# EAGLE design synthesizer-IF-Si4112-v1 (EAGLE 9.5.1)
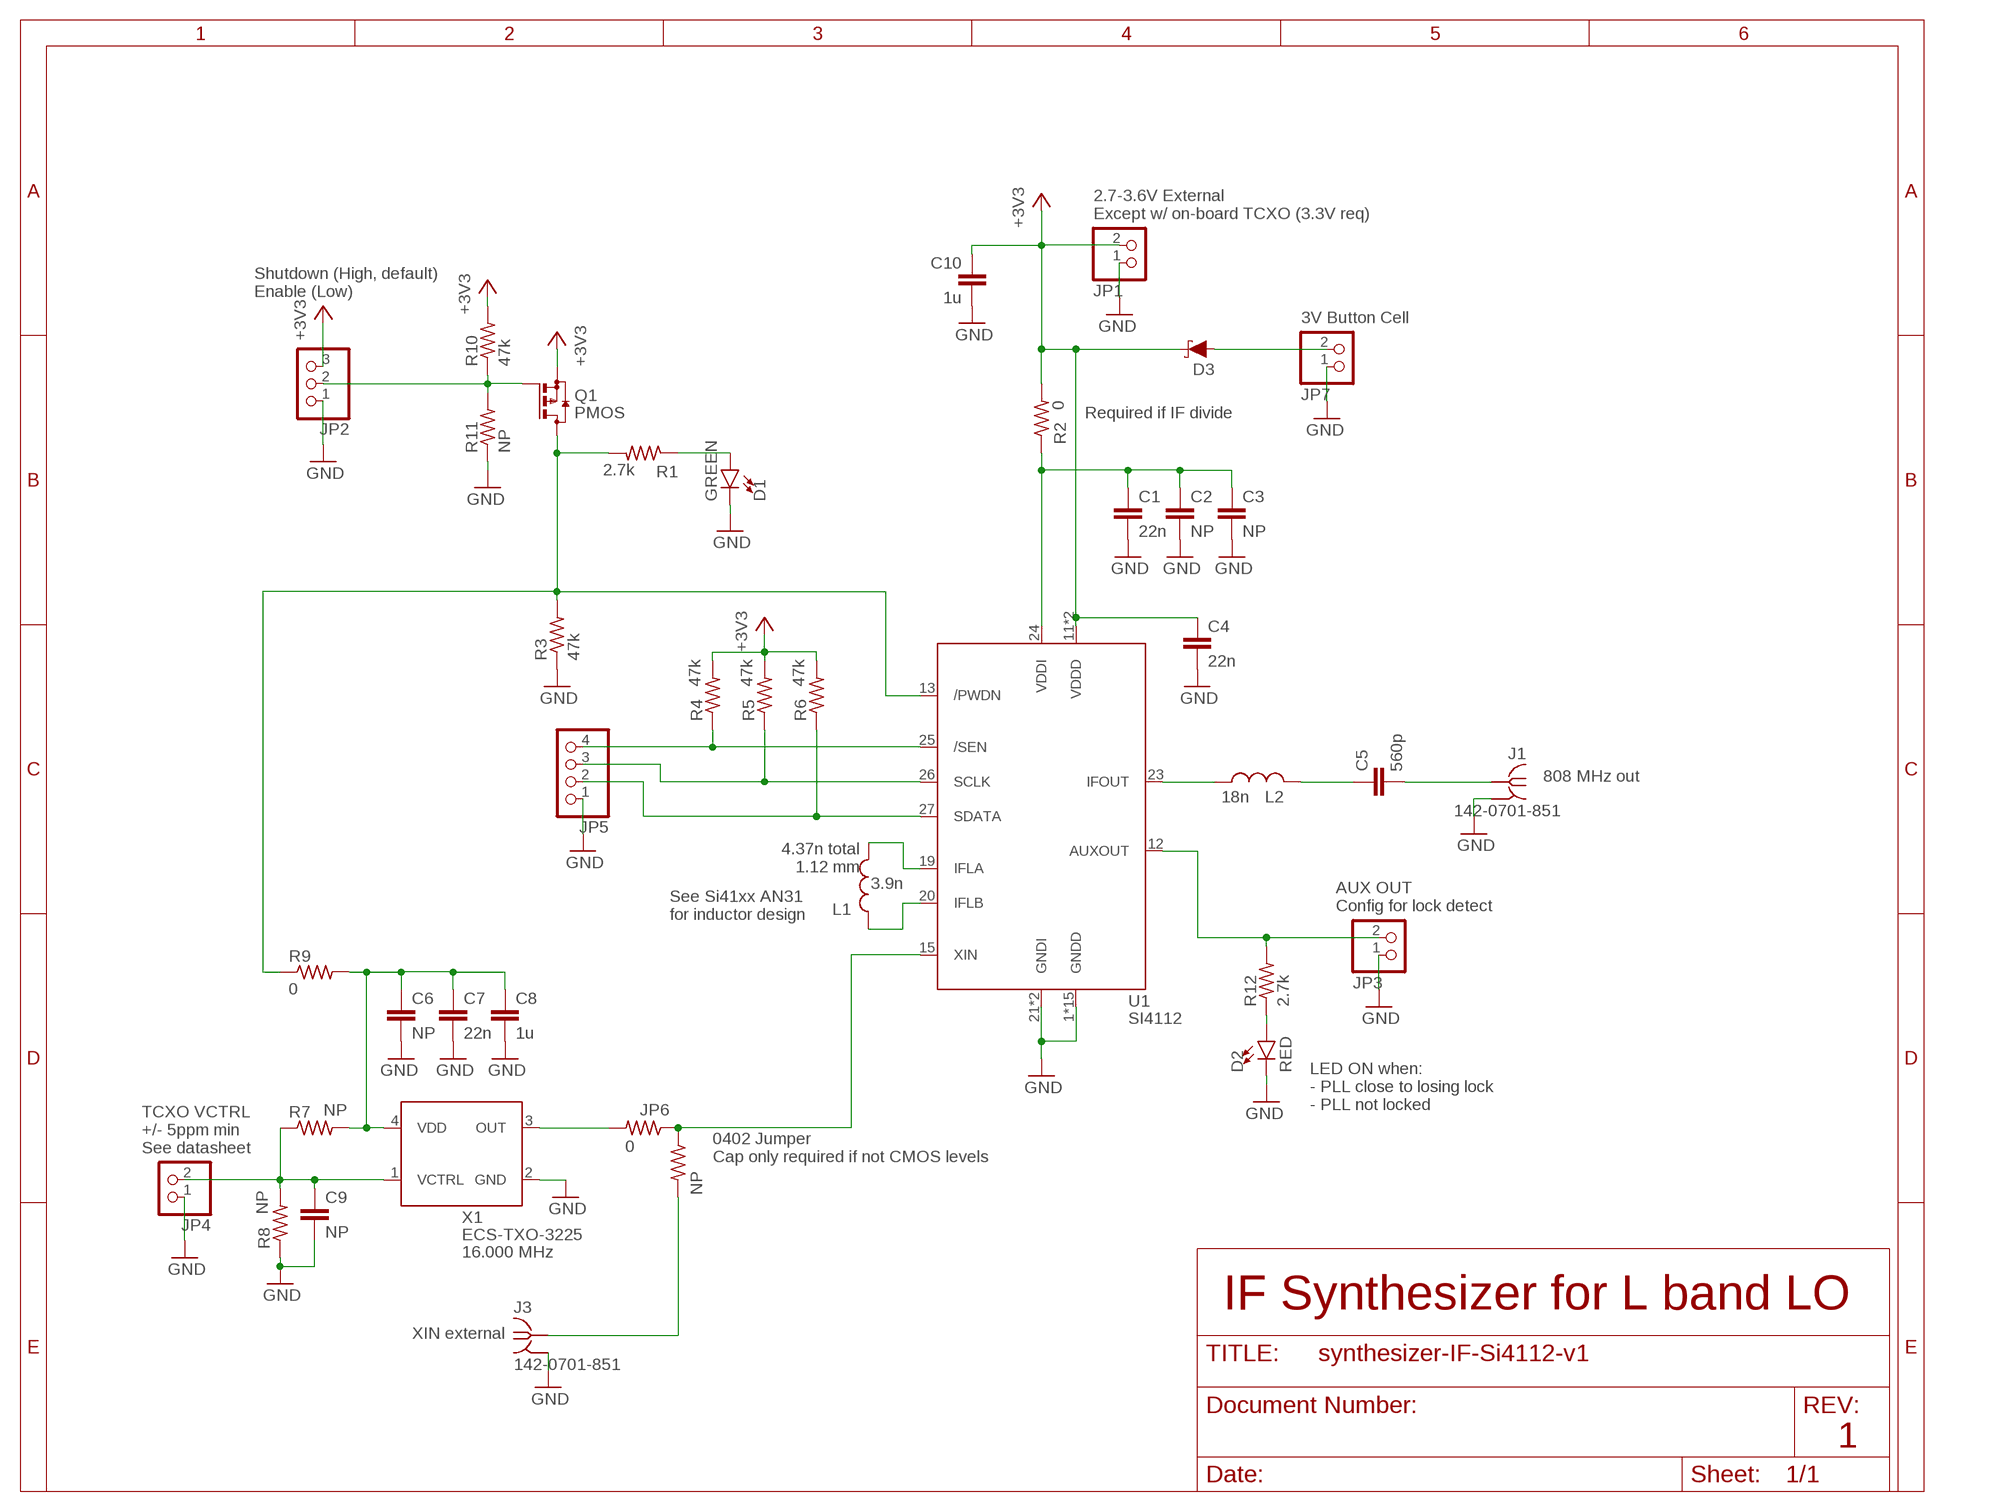
[diagram p0: schematic, sheet 1]

## Parts
C1  22n  C-EU0603-B-NOSILK  [.0603-B-NOSILK]
C2  NP  C-EU0603-B-NOSILK  [.0603-B-NOSILK]
C3  NP  C-EU0603-B-NOSILK  [.0603-B-NOSILK]
C4  22n  C-EU0603-B-NOSILK  [.0603-B-NOSILK]
C5  560p  C-EU0402-B-NOSILK  [.0402-B-NOSILK]
C6  NP  C-EU0603-B-NOSILK  [.0603-B-NOSILK]
C7  22n  C-EU0603-B-NOSILK  [.0603-B-NOSILK]
C8  1u  C-EU0603-B-NOSILK  [.0603-B-NOSILK]
C9  NP  C-EU0603-B-NOSILK  [.0603-B-NOSILK]
C10  1u  C-EU0603-B-NOSILK  [.0603-B-NOSILK]
D1  GREEN  LED-GREEN0603  [LED-0603]
D2  RED  LED-GREEN0603  [LED-0603]
D3  120mA/40V/370mV  DIODE-SCHOTTKY-RB751S40  [SOD-523]
J1  142-0701-851  [142-0701-851]
J3  142-0701-851  [142-0701-851]
JP1  PINHD-1X2  [1X02]
JP2  PINHD-1X3  [1X03]
JP3  PINHD-1X2  [1X02]
JP4  PINHD-1X2  [1X02]
JP5  PINHD-1X4  [1X04]
JP6  0  R-US_0402-B-NOSILK  [.0402-B-NOSILK]
JP7  PINHD-1X2  [1X02]
L1  3.9n  L-US0402-C-NOSILK  [.0402-C-NOSILK]
L2  18n  L-US0402-B-NOSILK  [.0402-B-NOSILK]
Q1  PMOS  BSS84  [SOT23]
R1  2.7k  R-US_0603-B-NOSILK  [.0603-B-NOSILK]
R2  0  R-US_0603-B-NOSILK  [.0603-B-NOSILK]
R3  47k  R-US_0402-B-NOSILK  [.0402-B-NOSILK]
R4  47k  R-US_0402-B-NOSILK  [.0402-B-NOSILK]
R5  47k  R-US_0402-B-NOSILK  [.0402-B-NOSILK]
R6  47k  R-US_0402-B-NOSILK  [.0402-B-NOSILK]
R7  NP  R-US_0603-B-NOSILK  [.0603-B-NOSILK]
R8  NP  R-US_0603-B-NOSILK  [.0603-B-NOSILK]
R9  0  R-US_0603-B-NOSILK  [.0603-B-NOSILK]
R10  47k  R-US_0402-B-NOSILK  [.0402-B-NOSILK]
R11  NP  R-US_0402-B-NOSILK  [.0402-B-NOSILK]
R12  2.7k  R-US_0603-B-NOSILK  [.0603-B-NOSILK]
R99  NP  R-US_0402-B-NOSILK  [.0402-B-NOSILK]
U1  SI4112  [QFN28-5X5-WITH-CENTER-PAD]
X1  ECS-TXO-3225  [3.2X2.5]

## Nets
+3V3: C4.1 C10.1 D3.C JP1.2 JP2.3 Q1.2(S) R2.2 R4.2 R5.2 R6.2 R10.2 U1.11(VDDD) U1.17(VDDD)
/SEN: JP5.4 R4.1 U1.25(/SEN)
AUX: JP3.2 R12.2 U1.12(AUXOUT)
GND: C1.2 C2.2 C3.2 C4.2 C6.2 C7.2 C8.2 C9.2 C10.2 D1.C D2.C J1.GND1(GND) J1.GND2(GND) J1.GND3(GND) J1.GND4(GND) J3.GND1(GND) J3.GND2(GND) J3.GND3(GND) J3.GND4(GND) JP1.1 JP2.1 JP3.1 JP4.1 JP5.1 JP7.1 R3.1 R8.1 R11.1 U1.1(GNDD) U1.2(GNDD) U1.3(GNDD) U1.4(GNDD) U1.5(GNDD) U1.6(GNDD) U1.7(GNDD) U1.8(GNDD) U1.9(GNDD) U1.10(GNDD) U1.14(GNDD) U1.16(GNDD) U1.18(GNDD) U1.21(GNDI) U1.22(GNDI) U1.28(GNDD) U1.PAD(GNDD) X1.2(GND)
IF_OUT [RF1]: C5.2 J1.RF1(RF)
N$1: D3.A JP7.2
N$2: L1.2 U1.19(IFLA)
N$3: L1.1 U1.20(IFLB)
N$4: JP2.2 Q1.1(G) R10.1 R11.2
N$5: Q1.3(D) R1.2 R3.2 R9.1 U1.13(/PWDN)
N$9 [RF3]: JP6.2 X1.3(OUT)
N$10: C6.1 C7.1 C8.1 R7.2 R9.2 X1.4(VDD)
N$11 [RF1]: C5.1 L2.2
N$21: D1.A R1.1
N$22: D2.A R12.1
N$25 [RF2]: L2.1 U1.23(IFOUT)
N$93: C1.1 C2.1 C3.1 R2.1 U1.24(VDDI)
REF_IN [RF1]: J3.RF1(RF) R99.2
SCLK: JP5.3 R5.1 U1.26(SCLK)
SDATA: JP5.2 R6.1 U1.27(SDATA)
VCTRL: C9.1 JP4.2 R7.1 R8.2 X1.1(VCTRL)
XIN [RF2]: JP6.1 R99.1 U1.15(XIN)

## Notes on the sheet
- 2.7-3.6V External
  Except w/ on-board TCXO (3.3V req)
- Shutdown (High, default)
  Enable (Low)
- 3V Button Cell
- Required if IF divide
- 808 MHz out
- 4.37n total
  1.12 mm
- AUX OUT
  Config for lock detect
- See Si41xx AN31
  for inductor design
- LED ON when:
  - PLL close to losing lock
  - PLL not locked
- TCXO VCTRL
  +/- 5ppm min
  See datasheet
- 0402 Jumper
  Cap only required if not CMOS levels
- 16.000 MHz
- IF Synthesizer for L band LO
- XIN external
- 1

## Library data of the parts
C1-C10 = oresat-rcl:C-EU: CAPACITOR, European symbol
D1 = SparkFun-LED:LED-GREEN: Green SMD LED Used in manufacturing of various products at SparkFun Packages: 0603 - SMD 0603 package [Product Link] <http://www.futureelectronics.com/en/technologies/semiconductors/optoelectronics/leds/Pages/9894312-LTST-C190GKT.aspx?CrossPart=HSMG-C190&IM=0> LilyPad 1206 - SMD1206 LilyPad package [Product Link] <http://www.futureelectronics.com/en/Technologies/Product.aspx?ProductID=IN150NGHARVATEKCORPORATION2049943&IM=0> 1206 - SMD1206 package [Product Link] <http://www.futureelectronics.com/en/technologies/semiconductors/optoelectronics/leds/Pages/8315665-LTST-C150KGKT.aspx?IM=0> 1206 Bottom Mount -SMD 1206 Bottom Mount [Product Link] <http://www.digikey.com/product-detail/en/lite-on-inc/LTST-C230KGKT/160-1456-1-ND/386854> SparkFun Products: Pro Mini 328 -5V <https://www.sparkfun.com/products/821> RedBoard <https://www.sparkfun.com/products/12757> MP3 Trigger <https://www.sparkfun.com/products/13720> Makey Makey <https://www.sparkfun.com/products/11076>
D2 = SparkFun-LED:LED-GREEN: Green SMD LED Used in manufacturing of various products at SparkFun Packages: 0603 - SMD 0603 package [Product Link] <http://www.futureelectronics.com/en/technologies/semiconductors/optoelectronics/leds/Pages/9894312-LTST-C190GKT.aspx?CrossPart=HSMG-C190&IM=0> LilyPad 1206 - SMD1206 LilyPad package [Product Link] <http://www.futureelectronics.com/en/Technologies/Product.aspx?ProductID=IN150NGHARVATEKCORPORATION2049943&IM=0> 1206 - SMD1206 package [Product Link] <http://www.futureelectronics.com/en/technologies/semiconductors/optoelectronics/leds/Pages/8315665-LTST-C150KGKT.aspx?IM=0> 1206 Bottom Mount -SMD 1206 Bottom Mount [Product Link] <http://www.digikey.com/product-detail/en/lite-on-inc/LTST-C230KGKT/160-1456-1-ND/386854> SparkFun Products: Pro Mini 328 -5V <https://www.sparkfun.com/products/821> RedBoard <https://www.sparkfun.com/products/12757> MP3 Trigger <https://www.sparkfun.com/products/13720> Makey Makey <https://www.sparkfun.com/products/11076>; VALUE: GREEN
D3 = SparkFun-DiscreteSemi:DIODE-SCHOTTKY: Schottky diode A Schottky diode is a semiconductor diode which has a low forward voltage drop and a very fast switching action.; PROD_ID: DIO-11018
J1 J3 = J-Cinch-142-0701-851-SMA-end-launch:142-0701-851: SMA Jack 50Ω - End Launch Source: Datasheet <https://belfuse.com/resources/productinformations/cinchconnectivitysolutions/johnson/pi-ccs-john-142-0701-851.pdf>
JP1 JP3 JP4 JP7 = pinhead:PINHD-1X2: PIN HEADER
JP2 = pinhead:PINHD-1X3: PIN HEADER
JP5 = pinhead:PINHD-1X4: PIN HEADER
JP6 R1-R12 R99 = oresat-rcl:R-US_: RESISTOR, American symbol
L1 L2 = oresat-rcl:L-US: INDUCTOR, American symbol
Q1 = transistor-small-signal:BSS84: P-CHANNEL MOS FET
U1 = U-Silicon-Labs-Si4133-synthesizer:SI4112: RF Synthesizer w/ integrated VCOs (IF OUT)
X1 = X-ECS-TXO-TCXO:ECS-TXO-3225: HCMOS TCXO Stability: 2.5ppm (-30 to +85 ℃) Source: Datasheet <https://ecsxtal.com/store/pdf/ECS-TXO-3225.pdf>

## Net classes
1 RF1: clearance 0.762 mm
2 RF2: clearance 0.203 mm
3 RF3: clearance 0.356 mm

## Board
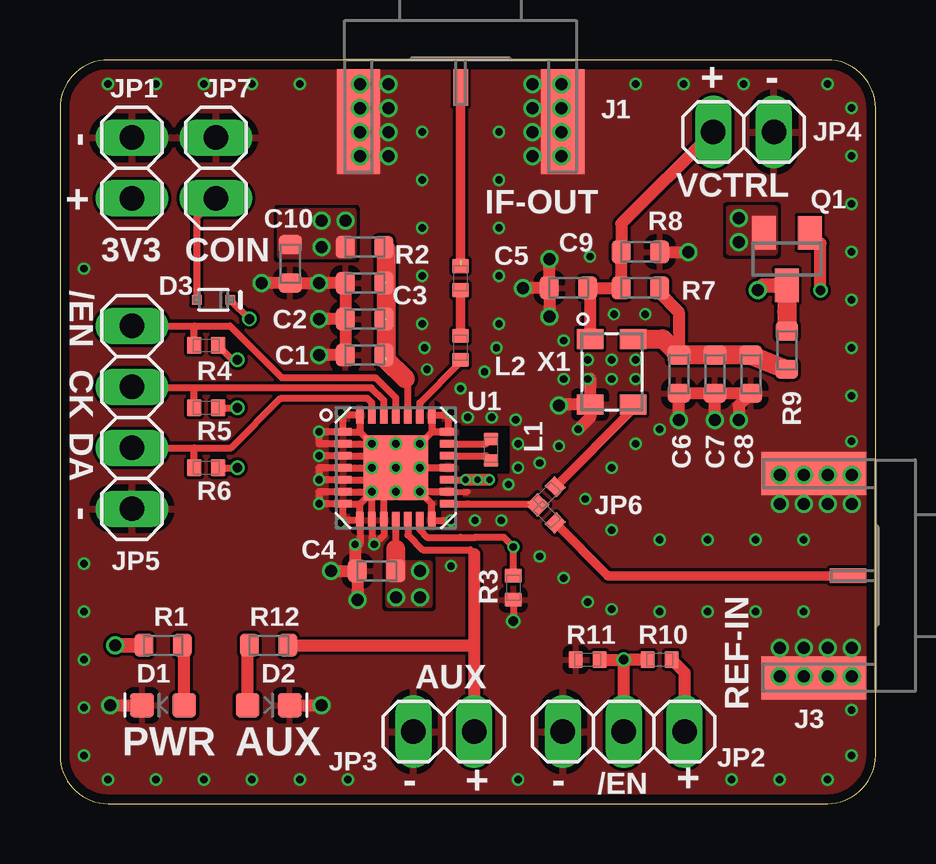
[diagram p1: board, top side]
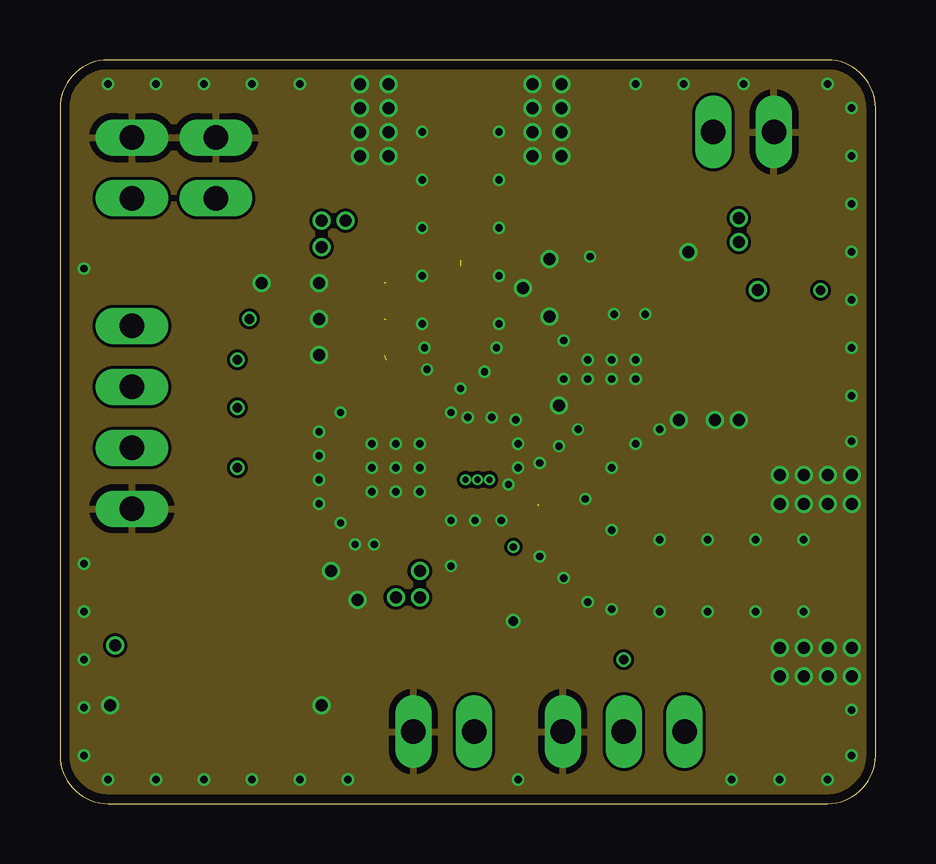
[diagram p2: board, inner layer Route2]
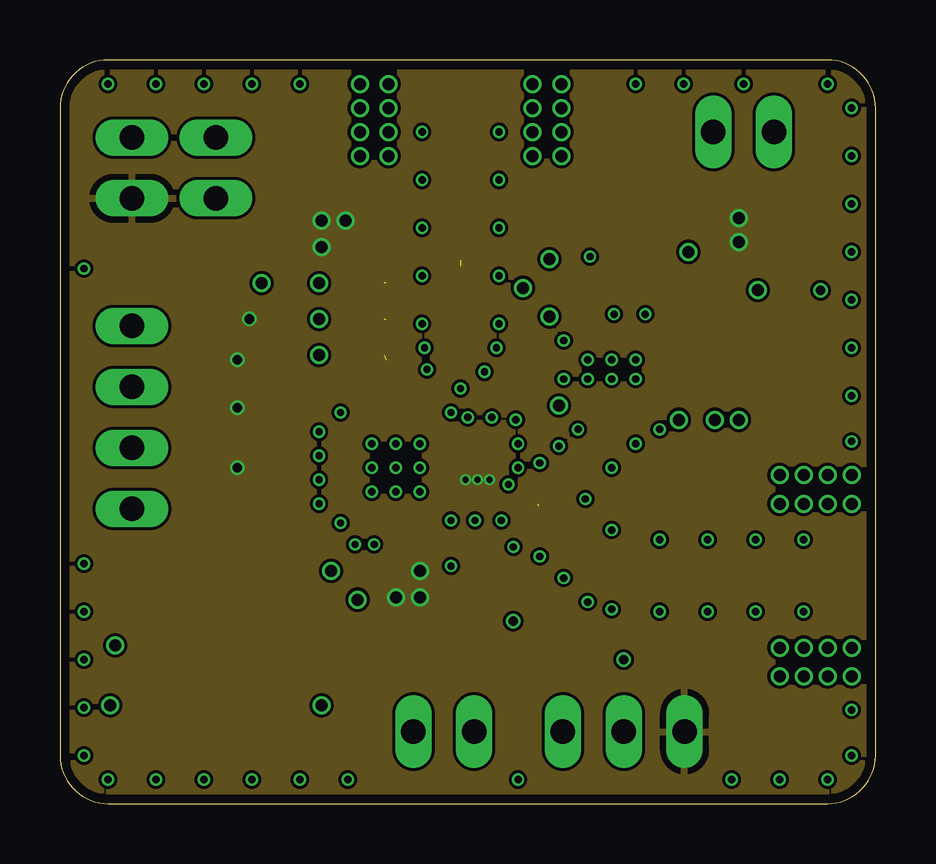
[diagram p3: board, inner layer Route15]
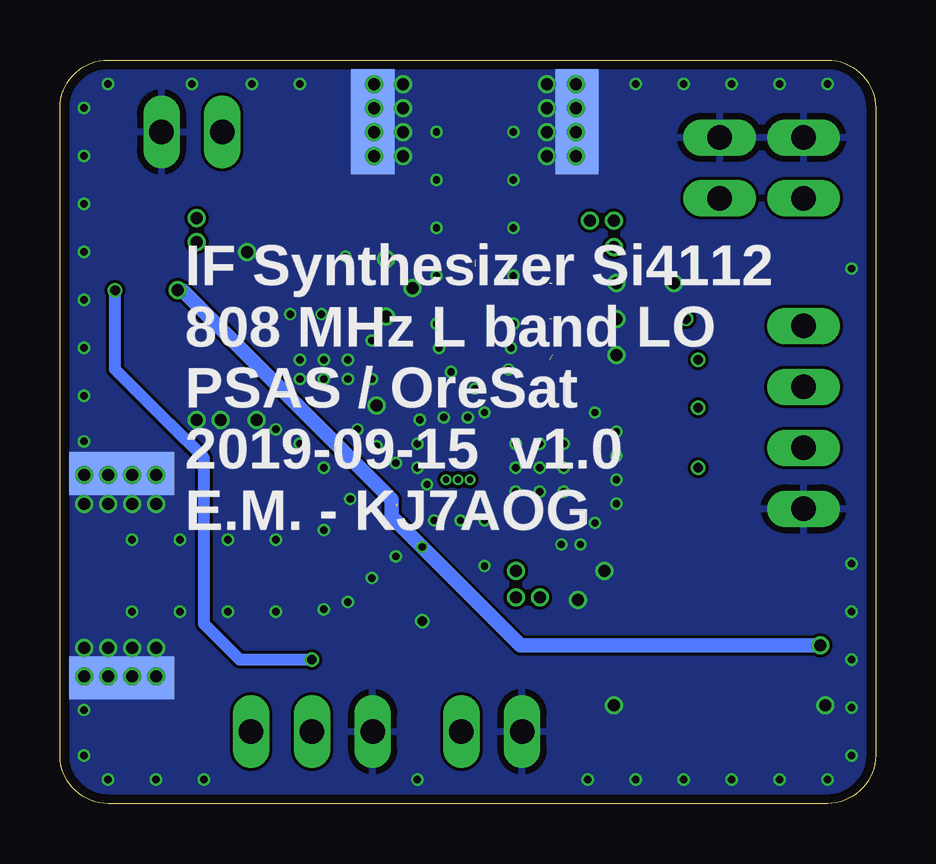
[diagram p4: board, bottom side, seen from below]

Size 34 x 31 mm. Coordinates in mm from the lower left corner, seen from the top.
Outline: 32,31 2,31 arc90 0,29 0,2 arc90 2,0 32,0 arc90 34,2 34,29 arc90 32,31
Copper layers (1*2*15*16): Top 0.035559375mm / dielectric 0.17018125mm / Route2 0.01778125mm / dielectric 47mil / Route15 0.01778125mm / dielectric 0.17018125mm / Bottom 0.035559375mm
Design rules "oshpark-4layer-tented": minimum track width 5mil, minimum drill 10mil, track to track 5mil, track to pad 5mil, pad to pad 5mil, via to via 5mil, smd to smd 5mil, copper to edge 15mil, drill to drill 6mil, minimum pad ring 4mil, minimum via ring 4mil, stop-mask expansion 2.5mil, vias tented up to drill 20mil, thermal gap 10mil

### Footprints (pad centres in the part's own frame; a part is rotated, then mirrored left to right if it is on the bottom)
.0603-B-NOSILK = smd 0.8 x 0.95: 1 -0.8,0; 2 0.8,0
.0402-B-NOSILK = smd 0.6 x 0.7: 1 -0.5,0; 2 0.5,0
LED-0603 = smd 1 x 1: A -0.877,0; C 0.877,0
SOD-523 = smd 0.4 x 0.4: A -0.7,0; C 0.7,0
142-0701-851 = smd 1.8 x 4.37: GND1 -4.255,-2.566; GND2 4.255,-2.566 | smd 1.8 x 4.37 bottom: GND3 -4.255,-2.566; GND4 4.255,-2.566 | smd 0.6 x 1.53: RF1 0,-1.146
1X02 = drill 1.016 long: 1 -1.27,0; 2 1.27,0
1X03 = drill 1.016 long: 1 -2.54,0; 2 0,0; 3 2.54,0
1X04 = drill 1.016 long: 1 -3.81,0; 2 -1.27,0; 3 1.27,0; 4 3.81,0
.0402-C-NOSILK = smd 0.5 x 0.6: 1 -0.45,0; 2 0.45,0
SOT23 = smd 1 x 1.4: 1 -0.95,-1.1; 2 0.95,-1.1; 3 0,1.1
QFN28-5X5-WITH-CENTER-PAD = smd 0.7 x 0.3: 1 -2.2,1.5; 2 -2.2,1; 3 -2.2,0.5; 4 -2.2,0; 5 -2.2,-0.5; 6 -2.2,-1; 7 -2.2,-1.5; 15 2.2,-1.5; 16 2.2,-1; 17 2.2,-0.5; 18 2.2,0; 19 2.2,0.5; 20 2.2,1; 21 2.2,1.5 | smd 0.3 x 0.7: 8 -1.5,-2.2; 9 -1,-2.2; 10 -0.5,-2.2; 11 0,-2.2; 12 0.5,-2.2; 13 1,-2.2; 14 1.5,-2.2; 22 1.5,2.2; 23 1,2.2; 24 0.5,2.2; 25 0,2.2; 26 -0.5,2.2; 27 -1,2.2; 28 -1.5,2.2 | smd 2.7 x 2.7: PAD 0,0
3.2X2.5 = smd 0.85 x 1.09: 1 -1.365,-0.895; 2 1.365,-0.895; 3 1.365,0.895; 4 -1.365,0.895

### Placement (x,y rotation side)
C1  12.7,18.7 180 top
C2  12.7,20.2 180 top
C3  12.7,21.7 180 top
C4  13.2,9.7 180 top
C5  16.7,21.9 90 top
C6  25.8,17.9 270 top
C7  27.3,17.9 270 top
C8  28.8,17.9 270 top
C9  21.2,21.5 180 top
C10  9.6,22.5 270 top
D1  4.3,4.1 180 top
D2  8.7,4.1 0 top
D3  6.4,21 0 top
J1  16.7,31 0 top
J3  34,9.5 270 top
JP1  3,26.5 270 top
JP2  23.5,3 0 top
JP3  16,3 0 top
JP4  28.5,28 180 top
JP5  3,16.1 90 top
JP6  20.3,12.85 45 top
JP7  6.5,26.5 270 top
L1  17.97,14.75 270 top
L2  16.7,19 90 top
Q1  30.3,22.7 180 top
R1  4.3,6.6 180 top
R2  12.7,23.2 180 top
R3  18.9,9 90 top
R4  6.1,19.1 0 top
R5  6.1,16.5 0 top
R6  6.1,14 0 top
R7  24.2,21.5 0 top
R8  24.2,23 180 top
R9  30.3,18.9 270 top
R10  25,6 0 top
R11  22,6 0 top
R12  8.7,6.6 0 top
R99  20.3,12.05 315 top
U1  14,14 0 top
X1  23,18 270 top

### Tracks (layer width: path | path; a pad name or v marks a point on that pad's centre or on a via)
+3V3  (via drill 0.25, 0.4, 0.5)
  Top 0.3: 14,10.6 U1.11 | R6.2 v7.4,14 | R5.2 v7.4,16.5 | U1.17 v16.9,13.5 | R4.2 7.2,18.5 v7.4,18.5 | D3.C v7.9,20.2
  Top 0.5: v17.9,13.5 v17.4,13.5 16.93,13.5 | R10.2 26.04,5.46 JP2.3
  Top 0.8: C4.1 14,10.6
  other vias: 15,9.7 14,8.6 15,8.6 11.9,24.3 10.9,23.2 10.9,24.3 28.3,23.4 28.3,24.4
  pour Route15: 0,31 34,31 34,0 0,0
  pour Top (no thermals): 12.21,22.82 9.2,22.82 9.2,24.7 12.21,24.7
  pour Top (no thermals): 15.4,10 13.7,10 13.7,8.3 15.4,8.3
  pour Top (no thermals): 29.8,23 29.8,24.8 27.9,24.8 27.9,23
/SEN
  Top 0.3: U1.25 14,16.91 13.15,17.75 9.25,17.75 7.09,19.91 5.6,19.91 | JP5.4 5.6,19.91 | R4.1 5.6,19.91
AUX
  Top 0.3: U1.12 14.5,11.2 15.12,10.57 17.1,10.57 17.27,10.4
  Top 0.5: 17.27,6.6 JP3.2 | R12.2 17.07,6.6 17.27,6.6 | 17.27,10.4 17.27,6.6
GND  (via drill 0.3, 0.4, 0.5)
  Top 0.26: U1.16 16.42,13 16.42,12.99 17,12.99
  Top 0.3: v10.8,14.5 U1.3 13,14.5 v13,14 | U1.1 v10.8,15.5 10.8,15 U1.2 v13,15 | U1.1 11.8,16.3 v11.7,16.3 11.7,16.2 U1.28 12.5,15.5 | U1.7 v10.8,12.5 10.8,13 U1.6 v13,13 | v11.7,11.7 11.8,11.7 | 11.8,11.7 U1.7 | U1.1 12.5,15.5 | 12.5,15.5 v13,15 | 12.5,15.5 v13,15 | v13,14 U1.4 10.8,14 v10.8,13.5 U1.5 13,13.5 v13,14 | v13,13 U1.9 13,10.8 v13.1,10.8 13.5,11.2 U1.10 13.5,13 v13,13 | U1.18 v15,14 | U1.16 v15,13 15.5,12.5 15.5,12.2 U1.14 v16.3,11.8 | 15.5,15.5 U1.22 16.2,16.2 16.2,16.3 | 15.5,15.5 v15,15 15.5,15.5 | 15.5,15.5 U1.21 16.2,16.3 | 16.2,16.3 v16.3,16.3 | U1.8 12.5,10.8 v12.3,10.8 | U1.8 11.8,11.8 11.8,11.7 | U1.8 12.5,12.5 | 12.5,12.5 v13,13 | U1.7 12.5,12.5 | 12.5,12.5 v13,13 | R3.1 v18.9,7.6
  Top 0.5: v2.1,4.1 D1.C | D2.C v10.9,4.1 | C4.2 v12.4,8.5 | v11.3,9.7 C4.2 | v12.3,10.8 12.3,9.7 C4.2 | C2.2 v10.8,20.2 | v10.8,18.7 C1.2 C2.2 | C2.2 C3.2 v10.8,21.7 C10.2 v8.4,21.7 | C9.2 v20.4,22.7 | C9.2 v19.3,21.5 | C9.2 v20.4,20.3 | R8.1 v26.2,23 | v25.8,16 C6.2 C7.2 | v27.3,16 C7.2 | v28.3,16 28.3,16.6 C8.2 C7.2 | X1.2 22.11,17.7 v22,17.7 | X1.2 20.8,16.64 v20.8,16.6 | X1.2 22.11,16.11 v21.6,15.6
  other vias: 18.4,11.8 17.3,11.8 18.7,13.3 22,18.5 24,17.7 24,18.5 23,18.5 23,17.7 14,15 14,13 14,14 19,16 19.1,15 19.1,14 18,16.1 17,16.1 21,19.3 21,17.7 23.1,20.4 24.4,20.4 22.1,22.8 21.9,12.7 25,15.6 24,15 23,14 20,14.2 20.8,14.9 20,10.3 21,9.4 22,8.4 23,11.4 23,8.1 31,11 29,11 27,11 25,11 31,8 29,8 27,8 25,8 15.3,18.1 16.7,17.3 17.7,18 18.2,19 15.2,19 15.1,28 18.3,28 15.1,26 15.1,24 18.3,26 18.3,24 15.1,22 15.1,20 18.3,22 18.3,20 16.3,9.9 2,30 4,30 6,30 8,30 10,30 32,30 33,29 28.5,30 26,30 24,30 33,17 33,19 33,21 33,25 33,27 33,2 33,3.9 32,1 30,1 28,1 19.1,1 2,1 4,1 6,1 8,1 10,1 12,1 1,2 1,4 1,6 1,8 1,10 1,22.3 33,13.7 32,13.7 31,13.7 30,13.7 30,12.5 31,12.5 32,12.5 33,12.5 33,5.3 32,5.3 31,5.3 30,5.3 30,6.5 31,6.5 32,6.5 33,6.5 20.9,30 20.9,29 20.9,28 20.9,27 19.7,30 19.7,29 19.7,28 19.7,27 13.7,30 13.7,29 13.7,28 13.7,27 12.5,27 12.5,28 12.5,29 12.5,30 33,23 33,15.1
  pour Top (rank 2): 0,31 34,31 34,0 0,0
  pour Bottom: 0,31 34,31 34,0 0,0
  pour Route2: 0,31 34,31 34,0 0,0
  cutout Top: 16.7,15.7 18.7,15.7 18.7,13.8 16.7,13.8
  pour Top (rank 2, no thermals): 29,4 34,4 34,15 29,15
  pour Top (rank 2, no thermals): 22,26 22,31 11,31 11,26
  pour Bottom (no thermals): 29,4 34,4 34,15 29,15
  pour Bottom (no thermals): 22,26 22,31 11,31 11,26
  pour Top: 13.7,5.2 13.7,1.2 27.3,1.2 27.3,5.2
  pour Top: 1,29.5 1,10.7 4.8,10.7 4.8,23.5 8.5,23.5 8.5,29.5
  pour Top: 25.4,26.1 25.4,29.9 31.4,29.9 31.4,26.1
  pour Top: 12,16 16,16 16,12 12,12
  cutout Top (no thermals): 13.5,15.8 13.5,15.4 14.5,15.4 14.5,15.8
  cutout Top (no thermals): 13.7,12.6 13.7,12.2 14.4,12.2 14.4,12.6
IF_OUT  (1 unrouted)
  Top 0.39: J1.RF1 16.7,22.66
N$1
  Top 0.3: JP7.2 5.7,24.43 D3.A
N$2
  Top 0.3: U1.19 17.77,14.5 L1.2
N$3
  Top 0.3: U1.20 17.77,15 L1.1
N$4  (via drill 0.4)
  Top 0.5: JP2.2 v23.5,6 | v31.7,21.4 31.7,23.35 Q1.1 | R11.2 v23.5,6 | R10.1 v23.5,6
  Bottom 0.5: v23.5,6 26.5,6 28,7.5 28,14.4 29.45,15.85 31.7,18.1 v31.7,21.4
N$5  (via drill 0.3, 0.5)
  Top 0.3: U1.13 15,11.41 15.31,11.1 16.68,11.1 17.32,11.1 18.5,11.1 v18.9,10.7 R3.2
  Top 0.6: Q1.3 29.3,21.6 v29.1,21.4 | v2.3,6.6 R1.2
  Top 0.8: Q1.3 30.3,20.5 R9.1
  Bottom 0.6: v2.3,6.6 14.8,6.6 v18.9,10.7 20.18,11.98 20.18,12.68 28.9,21.4 v29.1,21.4
N$9
  Top 0.39: X1.3 23.89,16.45 JP6.2
N$10
  Top 0.5: R7.2 25,21.3 25.8,20.5 C6.1
  Top 0.8: R9.2 C8.1 C7.1 C6.1 25.14,19.36 X1.4
N$11
  Top 0.39: L2.2 C5.1
N$21
  Top 0.5: D1.A 5.18,6.52 R1.1
N$22
  Top 0.5: D2.A 7.82,6.52 R12.1
N$25
  Top 0.3: U1.23 15,16.7 16.7,18.4 L2.1
N$93  (3 unrouted)
  Top 0.3: U1.24 14.5,17.6 14.4,17.7
  Top 0.8: R2.1 13.6,23.1 13.6,21.7 13.6,20.2 13.6,18.5 14.4,17.7
REF_IN
  Top 0.39: R99.2 22.85,9.5 J3.RF1
  pour Top (no thermals): 32.27,9.75 32.28,9.25 32.28,9.74
SCLK
  Top 0.3: U1.26 13.5,16.8 12.98,17.33 5.6,17.33 | 5.6,17.33 3.04,17.33 JP5.3 | R5.1 5.6,17.33
SDATA
  Top 0.3: U1.27 13,16.7 12.8,16.9 9.2,16.9 7.13,14.83 5.6,14.83 | JP5.2 5.6,14.83 | R6.1 5.6,14.83
VCTRL
  Top 0.5: X1.1 22.11,21.39 C9.1 R7.1 R8.2 23.4,24.17 JP4.2
XIN  (1 unrouted)
  Top 0.3: U1.15 17,12.5 19.85,12.5
  Top 0.39: 19.85,12.5 R99.1

### Text on the board
tPlace: + | - | - | VCTRL | + | IF-OUT | 3V3 | COIN | /EN | D3 | CK | DA | - | AUX | REF-IN | PWR | AUX | - | + | - | /EN | +
bPlace: IF Synthesizer Si4112 / 808 MHz L band LO / PSAS / OreSat / 2019-09-15 v1.0 / E.M. - KJ7AOG